# Altium schematic sheet logicLevel.SchDoc
size A4
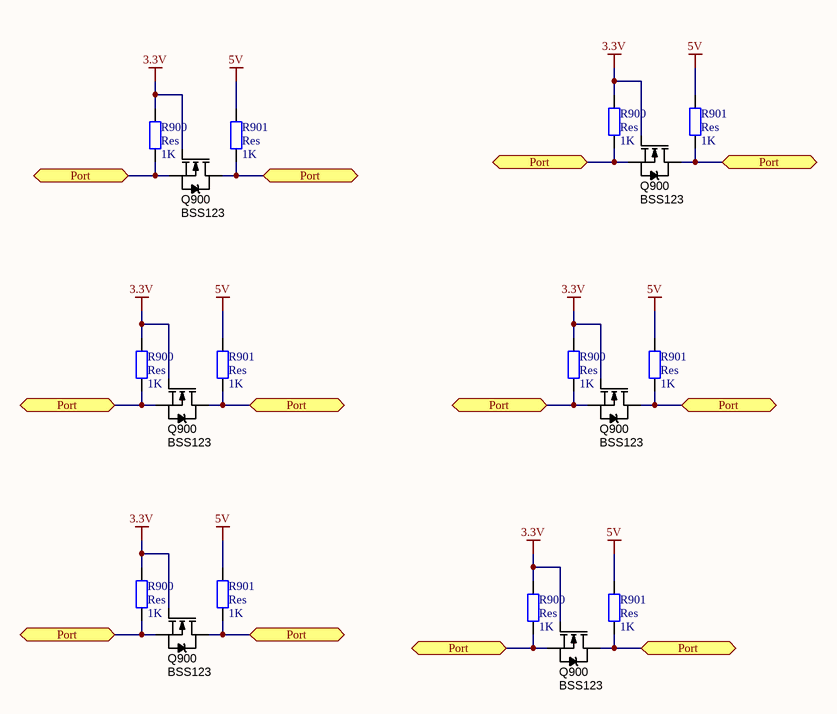
[diagram p0: logicLevel.SchDoc]

## Parts
(Parts that share a designator on the sheet are numbered #1, #2 ... from top to bottom, then left to right.)
Q900#1  BSS123  [SOT23-3]
Q900#2  BSS123  [SOT23-3]
Q900#3  BSS123  [SOT23-3]
Q900#4  BSS123  [SOT23-3]
Q900#5  BSS123  [SOT23-3]
Q900#6  BSS123  [SOT23-3]
R900#1  Res  value 1K  [1206 resistor]
R900#2  Res  value 1K  [1206 resistor]
R900#3  Res  value 1K  [1206 resistor]
R900#4  Res  value 1K  [1206 resistor]
R900#5  Res  value 1K  [1206 resistor]
R900#6  Res  value 1K  [1206 resistor]
R901#1  Res  value 1K  [1206 resistor]
R901#2  Res  value 1K  [1206 resistor]
R901#3  Res  value 1K  [1206 resistor]
R901#4  Res  value 1K  [1206 resistor]
R901#5  Res  value 1K  [1206 resistor]
R901#6  Res  value 1K  [1206 resistor]

## Ports
Port (bidir)

## Nets
3.3V: Q900#1.1(G) Q900#2.1(G) Q900#3.1(G) Q900#4.1(G) Q900#5.1(G) Q900#6.1(G) R900#1.2 R900#2.2 R900#3.2 R900#4.2 R900#5.2 R900#6.2
5V: R901#1.2 R901#2.2 R901#3.2 R901#4.2 R901#5.2 R901#6.2
Port: Q900#1.2(S) Q900#1.3(D) Q900#2.2(S) Q900#2.3(D) Q900#3.2(S) Q900#3.3(D) Q900#4.2(S) Q900#4.3(D) Q900#5.2(S) Q900#5.3(D) Q900#6.2(S) Q900#6.3(D) R900#1.1 R900#2.1 R900#3.1 R900#4.1 R900#5.1 R900#6.1 R901#1.1 R901#2.1 R901#3.1 R901#4.1 R901#5.1 R901#6.1 ; port Port

## Library data of the parts
Q900#1-Q900#6 = MOSFET_BSS123: MOSFET SMD N-CH 100V 170mA SOT23-3; Manufacturer 1: Diodes Inc; Manufacturer Part Number 1: BSS123-7-F; Ratings: 100V; 170mA; Material: Metal Oxide; SCDType: source; Package / Case: SOT23-3; Supplier 1: Digi-Key; Supplier Part Number 1: BSS123-FDICT-ND